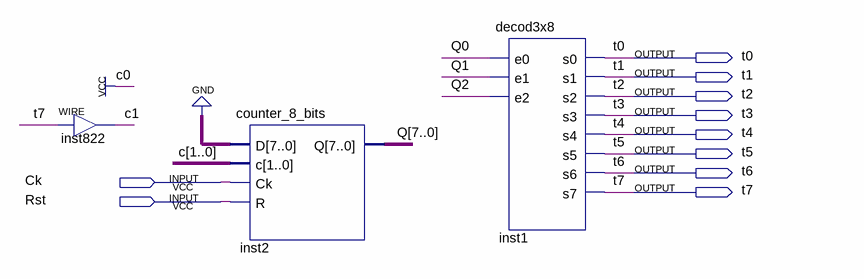
[diagram p0: schematic sheet]
// Quartus schematic m_inst_counter.bdf as structural Verilog: 3 symbols, 10 pins
module m_inst_counter (
  input  Ck,
  input  Rst,
  output t0,
  output t1,
  output t2,
  output t3,
  output t4,
  output t5,
  output t6,
  output t7
);

  wire [1:1] c;
  wire [7:0] Q;

  assign c[1] = t7;  // WIRE inst822
  counter_8_bits inst2 (.D({8{1'b0}}), .c({c[1], 1'b1}), .Ck(Ck), .R(Rst), .Q(Q));
  decod3x8 inst1 (
    .e0(Q[0]), .e1(Q[1]), .e2(Q[2]), .s0(t0), .s1(t1), .s2(t2), .s3(t3), .s4(t4), .s5(t5), .s6(t6), .s7(t7));
endmodule
